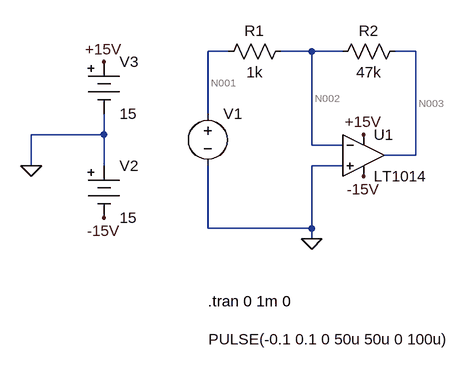
[diagram p0: schematic aufgabe2_invertierender_verstaerker_triangle2.asc]
aufgabe2_invertierender_verstaerker_triangle2.asc, the LTspice schematic file:
Version 4
SHEET 1 880 680
WIRE 48 176 16 176
WIRE 176 176 128 176
WIRE 224 176 176 176
WIRE 336 176 304 176
WIRE 16 272 16 176
WIRE -144 304 -144 272
WIRE -144 304 -256 304
WIRE 176 320 176 176
WIRE 224 320 176 320
WIRE 336 336 336 176
WIRE 336 336 288 336
WIRE -256 352 -256 304
WIRE -144 352 -144 304
WIRE 224 352 176 352
WIRE 16 448 16 352
WIRE 176 448 176 352
WIRE 176 448 16 448
WIRE 176 464 176 448
FLAG 176 464 0
FLAG 256 304 +15V
FLAG 256 368 -15V
FLAG -256 352 0
FLAG -144 432 -15V
FLAG -144 192 +15V
SYMBOL Opamps\\LT1014 256 272 R0
SYMATTR InstName U1
SYMBOL voltage 16 256 R0
WINDOW 123 0 0 Left 2
WINDOW 39 0 0 Left 2
WINDOW 3 1 363 Left 2
SYMATTR Value PULSE(-0.1 0.1 0 50u 50u 0 100u)
SYMATTR InstName V1
SYMBOL Misc\\battery -144 336 R0
WINDOW 123 0 0 Left 2
WINDOW 39 0 0 Left 2
SYMATTR InstName V2
SYMATTR Value 15
SYMBOL Misc\\battery -144 176 R0
WINDOW 123 0 0 Left 2
WINDOW 39 0 0 Left 2
SYMATTR InstName V3
SYMATTR Value 15
SYMBOL res 144 160 R90
WINDOW 0 0 56 VBottom 2
WINDOW 3 32 56 VTop 2
SYMATTR InstName R1
SYMATTR Value 1k
SYMBOL res 320 160 R90
WINDOW 0 0 56 VBottom 2
WINDOW 3 32 56 VTop 2
SYMATTR InstName R2
SYMATTR Value 47k
TEXT 16 560 Left 2 !.tran 0 1m 0

The netlist it stands for:
* aufgabe2_invertierender_verstaerker_triangle2.asc
XU1 0 N002 +15V -15V N003 LT1014  ; pins In+ In- V+ V- OUT
V1 N001 0 PULSE(-0.1 0.1 0 50u 50u 0 100u)
V2 0 -15V 15
V3 +15V 0 15
R1 N002 N001 1k
R2 N003 N002 47k
.tran 0 1m 0
.backanno
.end

* Results of the author's LTspice run, read from the files saved beside the schematic
* Operating Point, zero values left out:
*   V(n002) = -676.5 nV
*   V(+15v) = 15 V
*   V(-15v) = -15 V
*   V(n003) = 4.699 V
*   V(n001) = -100 mV
*   I(R2) = 99.99 µA
*   I(R1) = 100 µA
*   I(V3) = -401.8 µA
*   I(V2) = -301.8 µA
*   I(V1) = 100 µA
*   Ix(u1:1) = -12.02 nA
*   Ix(u1:2) = -12.02 nA
*   Ix(u1:3) = 401.8 µA
*   Ix(u1:4) = -301.8 µA
*   Ix(u1:5) = -99.99 µA
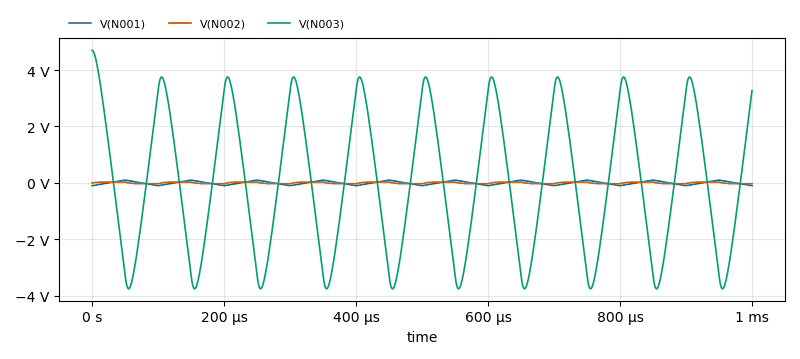
[diagram p1: Transient Analysis of aufgabe2_invertierender_verstaerker_triangle2.asc, plotted from the saved traces]
* Transient Analysis, 1 run:
*   V(N001): min -100 mV, max 100 mV, average 0 V, rms 58.27 mV, last -100 mV
*   V(N002): min -29.63 mV, max 29.69 mV, average 214.1 µV, rms 24.82 mV, last -29.63 mV
*   V(N003): min -3.756 V, max 4.699 V, average 9.713 mV, rms 2.489 V, last 3.277 V